# Altium schematic sheet MotorDriver.SchDoc
size A4; SheetNumber: 4; SheetTotal: 6
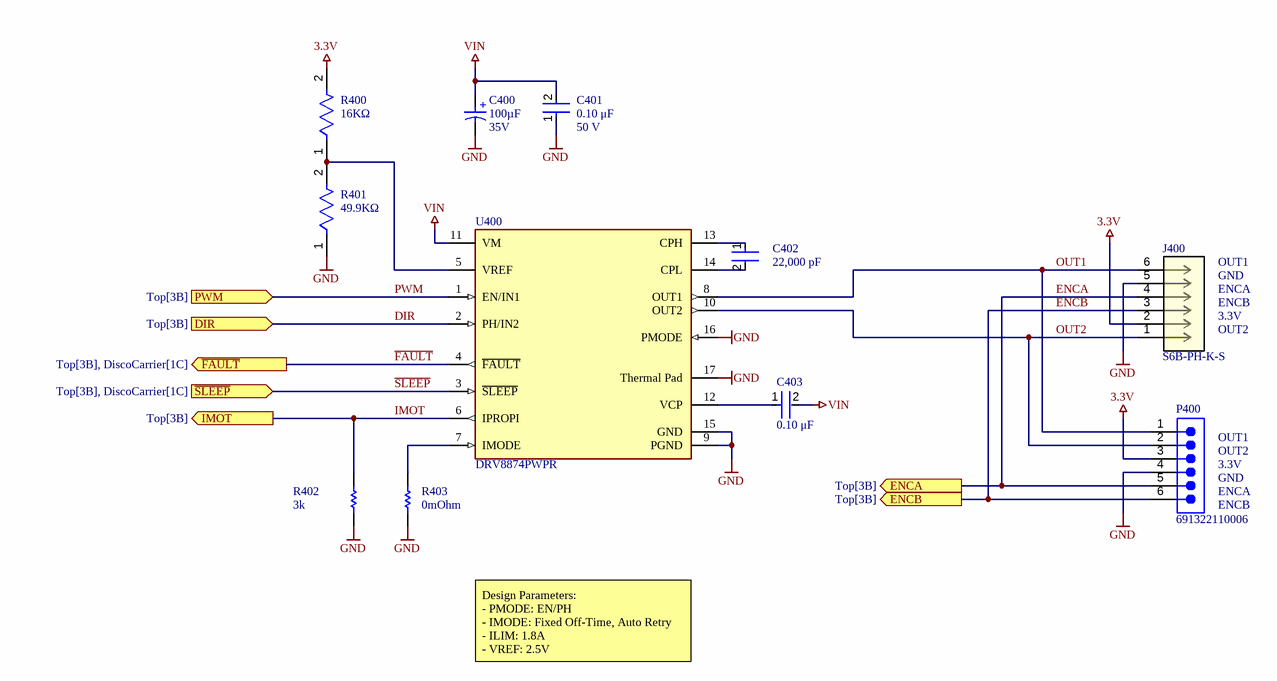
[diagram p0: MotorDriver.SchDoc]

## Parts
C400  Voltage Rating (DC): 35V  Capacitance: 100µF  [WCAP-ASLI_D6.3H7.7]  (hidden comment: 865080545012)
C401  value 0.10 μF  Voltage Rating: 50 V  [FP-C0603C-CF-MFG]  (hidden comment: C0603C104M5RACTU)
C402  value 22,000 pF  [FP-C0603C-CF-MFG]  (hidden comment: C0603C223M5RACTU)
C403  value 0.10 μF  [FP-C0603C-CF-MFG]  (hidden comment: C0603C104M5RACTU)
J400  S6B-PH-K-S  [CONN_S6B-PH-K-S_JST]
P400  691322110006  [691322110006]
R400  value 16KΩ  [FP-RT0603-MFG]  (hidden comment: RT0603FRE0716KL)
R401  value 49.9KΩ  [FP-RT0603-MFG]  (hidden comment: RT0603FRE0749K9L)
R402  Parameter 1: 3k  [RESC1608X55X25LL10T15]  (hidden comment: RT0603FRE073KL)
R403  Resistance: 0mOhm  [RESC1608X55X25ML10T15]  (hidden comment: RC0603JR-070RL)
U400  DRV8874PWPR  [FP-PWP0016J-MFG]

## Ports
DIR (in, see Top[3B]), ENCA (out, see Top[3B]), ENCB (out, see Top[3B]), IMOT (out, see Top[3B]), PWM (in, see Top[3B]), ~{FAULT} (out, see Top[3B], DiscoCarrier[1C]), ~{SLEEP} (in, see Top[3B], DiscoCarrier[1C])

## Nets
3.3V: J400.2 P400.3 R400.2
GND: C400.2(N) C401.1 J400.5 P400.4 R401.1 R402.1 R403.1 U400.9(PGND) U400.15(GND) U400.16(PMODE) U400.17(Thermal_Pad)
VIN: C400.1(P) C401.2 C403.2 U400.11(VM)
DIR: U400.2(PH/IN2) ; port DIR
ENCA: J400.4 P400.5 ; port ENCA
ENCB: J400.3 P400.6 ; port ENCB
~{FAULT}: U400.4(~{FAULT}) ; port ~{FAULT}
IMOT: R402.2 U400.6(IPROPI) ; port IMOT
OUT1: J400.6 P400.1 U400.8(OUT1)
OUT2: J400.1 P400.2 U400.10(OUT2)
PWM: U400.1(EN/IN1) ; port PWM
~{SLEEP}: U400.3(~{SLEEP}) ; port ~{SLEEP}
NetC402_1: C402.1 U400.13(CPH)
NetC402_2: C402.2 U400.14(CPL)
NetC403_1: C403.1 U400.12(VCP)
NetR400_1: R400.1 R401.2 U400.5(VREF)
NetR403_2: R403.2 U400.7(IMODE)

## Notes on the sheet
- OUT1
- 3.3V
- GND
- ENCA
- ENCB
- OUT2
- (near P400) OUT1
- (near P400) OUT2
- (near P400) 3.3V
- (near P400) GND
- (near P400) ENCA
- (near P400) ENCB
- Design Parameters:
  - PMODE: EN/PH
  - IMODE: Fixed Off-Time, Auto Retry
  - ILIM: 1.8A
  - VREF: 2.5V
- Project:
- Board:
- Title:
- Size:
- Sheet:
- A4
- of
- Drawn by:
- Revision:
- Date:
- Variant:
- Source Engineers GmbH | CH-3012 Bern
- File:
- (in symbol CMP-03913-54202496-1) +

## Library data of the parts
C400 = CMP-03913-54202496-1: 865080545012 Cap Aluminum Lytic 100uF 35V 20% (6.3 X 7.7mm) SMD 300mA 2000h 105C T/R; Leakage Current: 35µA; Impedance: 380mΩ; Life (Hours): 2000hours; Dissipation Factor: 14%; Insulation Resistance: 1MΩ; ESR (Equivalent Series Resistance): 321.392mΩ; Case/Package: Radial; Packaging: Cut Tape; REACH SVHC: Unknown; Diameter: 6.3mm; Min Operating Temperature: -55°C; Ripple Current: 300mA; Height: 7.7mm; Voltage Rating: 35V; RoHS: Compliant; Width: 6.6mm; Ripple Current (AC): 300mA; NexarPartId: 54202496; Max Operating Temperature: 105°C; Tolerance: 20%; Length: 7.7mm
C401 C403 = CMP-2006-03068-2: CAP CER 0.1UF 50V 20% X7R 0603; Manufacturer: KEMET; Material: Ceramic; Tolerance: 0.2; Temperature Coefficient: 30ppm/°C; Automotive Grade: Grade 1; Temperature Range High: +125°C; Device Class L3: Ceramic Capacitors; Manufacturer Part Number: C0603C104M5RACTU; Height: 0.87mm; Category: Cap; RoHS: TRUE; Digikey Description: CAP CER 0.1UF 50V 20% X7R 0603; ComponentLink2URL: https://api.kemet.com/component-edge/download/datasheet/C0603C100J5GACAUTO.pdf; Lead Free: Yes; Temperature Range Low: -55°C; Device Class L1: Passive Components; ComponentLink2Description: Datasheet; Temperature Characteristic: X7R; Automotive: Yes; Temperature: -55°C to +125°C; Octopart: https://octopart.com/c0603c104m5ractu-kemet-11855687; Device Class L2: Capacitors; Package: C0603C-CF; Mouser Description: Multilayer Ceramic Capacitors MLCC - SMD/SMT 50volts 0.1uF X7R 20%; Capacitance: 0.10 μF
  C403: Voltage Rating: 50 V
C402 = CMP-2006-03144-2: CAP CER 0.022UF 50V X7R 0603; Manufacturer: KEMET; Automotive Grade: Grade 1; Temperature Coefficient: 30ppm/°C; Material: Ceramic; Tolerance: 0.2; Manufacturer Part Number: C0603C223M5RACTU; Device Class L3: Ceramic Capacitors; Octopart: https://octopart.com/c0603c223m5ractu-kemet-18481184; Height: 0.87mm; Device Class L1: Passive Components; RoHS: TRUE; Temperature Characteristic: X7R; ComponentLink2Description: Datasheet; ComponentLink2URL: https://api.kemet.com/component-edge/download/datasheet/C0603C100J5GACAUTO.pdf; Category: Cap; Temperature Range Low: -55°C; Digikey Description: CAP CER 0.022UF 50V X7R 0603; Automotive: Yes; Package: C0603C-CF; Lead Free: Yes; Temperature Range High: +125°C; Mouser Description: Cap Ceramic 0.022uF 50V X7R 20% SMD 0603 125°C Paper T/R; Voltage Rating: 50 V; Temperature: -55°C to +125°C; Capacitance: 22,000 pF; Device Class L2: Capacitors
J400 = S6B-PH-K-S: Description; Manufacturer_Name: JST; Copyright: Copyright (C) 2025 Ultra Librarian. All rights reserved.; Manufacturer_Part_Number: S6B-PH-K-S; RefDes: RefDes; Type: Type; Supplier 1: Mouser; Supplier Part Number 1: 306-S6B-PH-K-SLFSN; Supplier 2: DigiKey; Supplier Part Number 2: 455-1723-ND
P400 = CMP-1502-01795-2: NexarPartId: 18818350; Number of Contacts: 6; Voltage: 300V; Current: 10A; Number of Levels: 1; Pitch: 3.5052mm; Gender: Male; Connector Type: PCB, Terminal Block; REACH SVHC: Unknown; Height: 9.2mm; Width: 22.1mm; Number of Positions Per Level: 6; Contact Material: Brass; Mount: Through Hole; Contact Gender: Male; RoHS: Compliant; Packaging: Box; Color: Green; Length: 10.5mm; Lead Pitch: 3.5mm; Number of Rows: 1; Number of Pins: 6; Termination: Solder
R400 = CMP-2000-04660-2: RES SMD 16K OHM 1% 1/10W 0603; Manufacturer: Yageo; Voltage Rating: 75V; Temperature Coefficient: 50 ppm/°C; Power Rating: 0.1W; Tolerance: 0.01; Package: RT0603; Automotive: No; Octopart: https://octopart.com/rt0603fre0716kl-yageo-1480398; Manufacturer Part Number: RT0603FRE0716KL; Device Class L1: Passive Components; Composition: Thin Film; Height: 0.55mm; Footprint Url: http://www.yageo.com/exep/pages/download/literatures/PYu-R_Mount_10.pdf; Series: RT; Lead Free: Yes; Device Class L2: Resistors; Device Class L3: Chip SMD Resistors; ComponentLink2Description: Datasheet; Mouser Description: Thin Film Resistors - SMD 1/10W 16K ohm 1% 50ppm; ComponentLink2URL: http://www.yageo.com/documents/recent/PYu-RT_1-to-0.01_RoHS_L_9.pdf; Ipc Land Pattern Name: RESC16080X45; Resistance: 16KΩ; Category: Res; RoHS: TRUE; Temperature Range Low: -55°C; Temperature Range High: +155°C; Temperature: -55°C to +155°C; Digikey Description: RES SMD 16K OHM 1% 1/10W 0603
R401 = CMP-2000-04756-2: RES SMD 49.9K OHM 1% 1/10W 0603; Manufacturer: Yageo; Tolerance: 0.01; Voltage Rating: 75V; Temperature Coefficient: 50 ppm/°C; Power Rating: 0.1W; Height: 0.55mm; Series: RT; Footprint Url: http://www.yageo.com/exep/pages/download/literatures/PYu-R_Mount_10.pdf; Category: Res; Temperature: -55°C to +155°C; ComponentLink2URL: http://www.yageo.com/documents/recent/PYu-RT_1-to-0.01_RoHS_L_9.pdf; Temperature Range High: +155°C; Device Class L2: Resistors; Ipc Land Pattern Name: RESC16080X45; RoHS: TRUE; Composition: Thin Film; Package: RT0603; Automotive: No; Lead Free: Yes; Resistance: 49.9KΩ; Manufacturer Part Number: RT0603FRE0749K9L; Mouser Description: Thin Film Resistors - SMD 1/10W 49.9K ohm 1% 50ppm; Device Class L3: Chip SMD Resistors; Digikey Description: RES SMD 49.9K OHM 1% 1/10W 0603; ComponentLink2Description: Datasheet; Temperature Range Low: -55°C; Device Class L1: Passive Components; Octopart: https://octopart.com/rt0603fre0749k9l-yageo-1469374
R402 = CMP-2000-04746-1: Manufacturer: Yageo; Part Number: RT0603FRE073KL
R403 = CMP-2100-03667-1: Chip Resistor, 0 Ohm, +/- 5%, 0.1 W, -55 to 155 degC, 0603 (1608 Metric), RoHS, Tape and Reel; Manufacturer: Yageo; Temperature Coefficient: 200ppm/degreesC; Voltage Rating: 50V; Power Rating: 100mW; Width: 0.8mm; Max Operating Temperature: 155degC; Tolerance: 5%; Package Reference: 0603; Height: 0.45mm; Depth: 0.8mm; Package Description: 2-Pin Surface Mount Device, Body 1.6 x 0.8 mm; Termination: SMD/SMT; Package Quantity: 5000; Case/Package: 0603; Case Code (Imperial): 0603; Radiation Hardening: No; Number of Pins: 2; Length: 1.6mm; Lead Free: LeadFree; Voltage Rating (DC): 50V; Military Standard: Not; Datasheet URL: http://www.yageo.com/NewPortal/yageodocoutput?fileName=/pdf/R-Chip/PYu-RC_Group_51_RoHS_L_5.pdf; Manufacturer URL: http://www.yageo.com/; Packaging: TapeandReel; Case Code (Metric): 1608; Min Operating Temperature: -55degC; Composition: ThickFilm; RoHSCompliant: true; Contact Plating: Tin; Datasheet Version: Rev. 5, 10/2016; REACH SVHC: NoSVHC
U400 = CMP-04915-000011-1: DRV8874 H-BRIDGE MOTOR DRIVER; RoHS Compliant: Yes